# Altium schematic sheet STRWHL-S07-V00-EncoderInput.SchDoc: Encoder Input
size A3; DrawnBy: Jonn Dillon; DocumentNumber: 7; Revision: 00; SheetNumber: 7; SheetTotal: 9; Project: Steering Wheel 2020
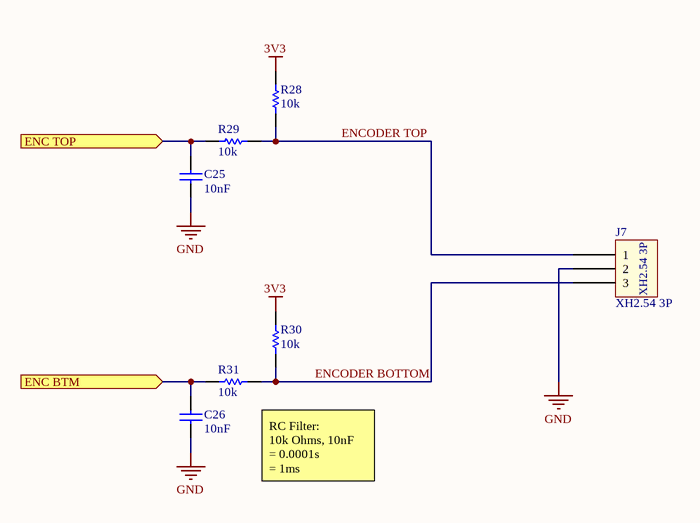
[diagram p0: STRWHL-S07-V00-EncoderInput.SchDoc]

## Parts
C25  10nF  [Cap_Ceramic_0603]
C26  10nF  [Cap_Ceramic_0603]
J7  XH2.54 3P  [JST_XH254_3P_TH_RH]
R28  10k  [Res_ThinFilm_0603]
R29  10k  [Res_ThinFilm_0603]
R30  10k  [Res_ThinFilm_0603]
R31  10k  [Res_ThinFilm_0603]

## Ports
ENC BTM (in), ENC TOP (in)

## Nets
3V3: R28.2 R30.2
GND: C25.1 C26.1 J7.2
ENC BTM: C26.2 R31.2 ; port ENC BTM
ENC TOP: C25.2 R29.1 ; port ENC TOP
ENCODER BOTTOM: J7.3 R30.1 R31.1
ENCODER TOP: J7.1 R28.1 R29.2

## Notes on the sheet
- (near R31) RC Filter:
  10k Ohms, 10nF
  = 0.0001s
  = 1ms
- Revision History:
- Sheet Title:
- Rev
- Date
- Description
- Project:
- Size:
- Drawn By:
- A3
- Number:
- Revision:
- Sheet
- Version:
- of
- QUT Motorsport
- O-120, Gardens Point
- 2 George Street
- Brisbane, QLD 4000
- Australia
- Print Date:
- Print Time:
- File Name:

## Library data of the parts
C25 C26 = 10nF 50V 5% X7R 0603: Capacitor, Ceramic, SMD, 10nF, 50V, 5%, X7R, 0603
R28-R31 = 10k 5% 0603: Resistor, SMD, 10k, 0.1W, 5%, 0603